# EAGLE schematic triple8_v2 (EAGLE 5.06)
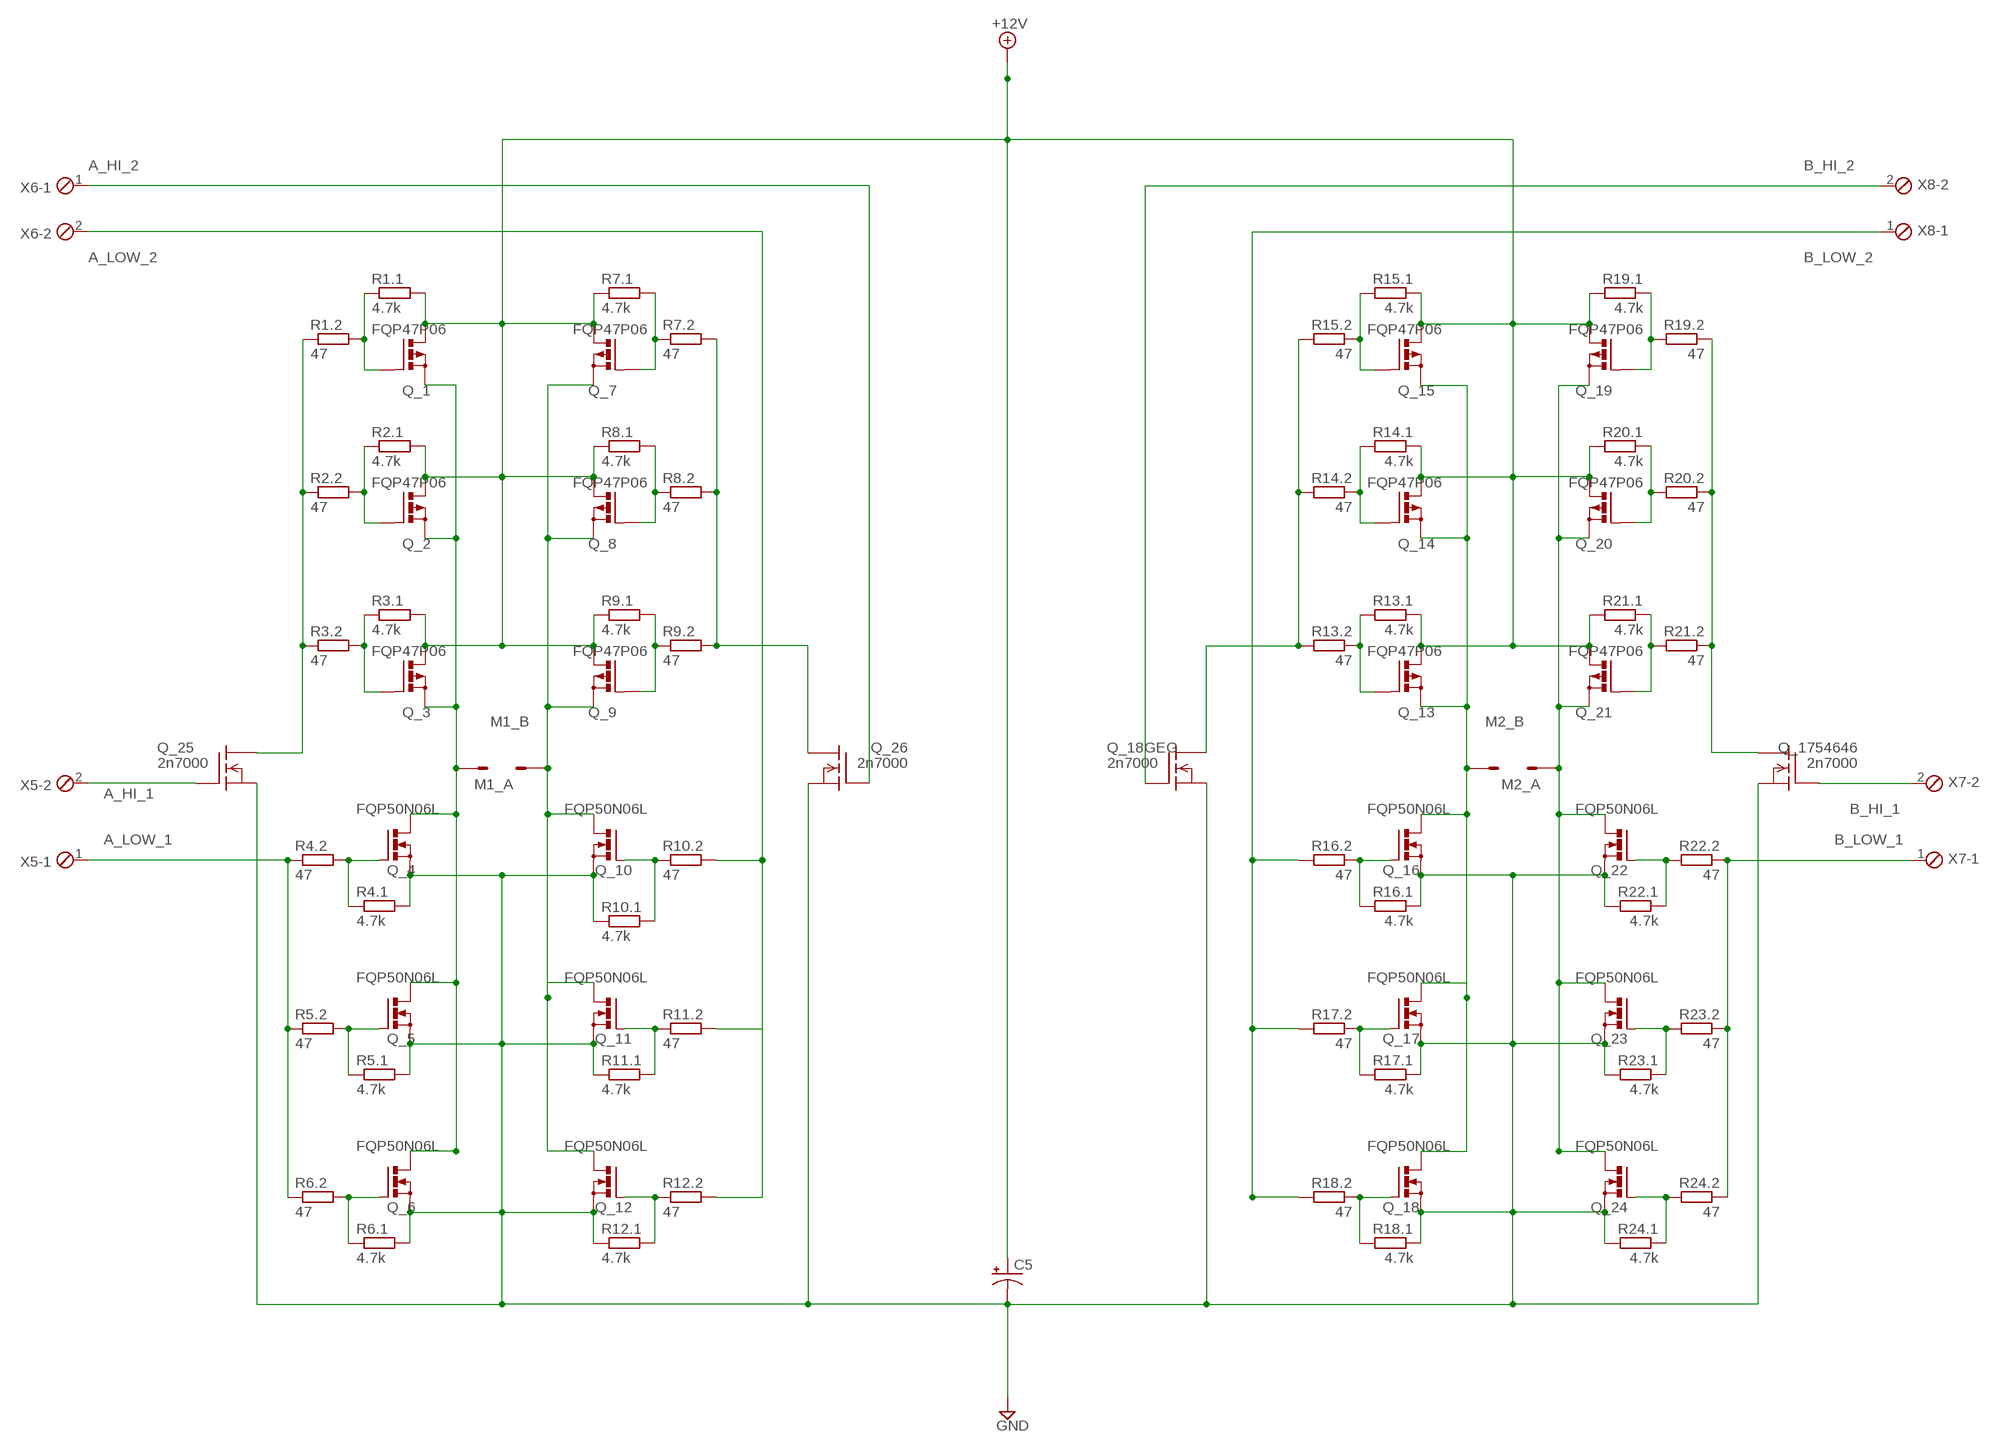
[diagram p0: schematic, sheet 1]

## Parts
C5  CPOL-USE10-22.5  [EB22,5D]
M1_A  ST2,8  [ST2,8]
M1_B  ST2,8  [ST2,8]
M2_A  ST2,8  [ST2,8]
M2_B  ST2,8  [ST2,8]
Q_1  FQP47P06  PMOSFET_PTO220BV  [TO220BV]
Q_2  FQP47P06  PMOSFET_PTO220BV  [TO220BV]
Q_3  FQP47P06  PMOSFET_PTO220BV  [TO220BV]
Q_4  FQP50N06L  PMOSFET_NTO220BV  [TO220BV]
Q_5  FQP50N06L  PMOSFET_NTO220BV  [TO220BV]
Q_6  FQP50N06L  PMOSFET_NTO220BV  [TO220BV]
Q_7  FQP47P06  PMOSFET_PTO220BV  [TO220BV]
Q_8  FQP47P06  PMOSFET_PTO220BV  [TO220BV]
Q_9  FQP47P06  PMOSFET_PTO220BV  [TO220BV]
Q_10  FQP50N06L  PMOSFET_NTO220BV  [TO220BV]
Q_11  FQP50N06L  PMOSFET_NTO220BV  [TO220BV]
Q_12  FQP50N06L  PMOSFET_NTO220BV  [TO220BV]
Q_13  FQP47P06  PMOSFET_PTO220BV  [TO220BV]
Q_14  FQP47P06  PMOSFET_PTO220BV  [TO220BV]
Q_15  FQP47P06  PMOSFET_PTO220BV  [TO220BV]
Q_16  FQP50N06L  PMOSFET_NTO220BV  [TO220BV]
Q_17  FQP50N06L  PMOSFET_NTO220BV  [TO220BV]
Q_18  FQP50N06L  PMOSFET_NTO220BV  [TO220BV]
Q_18GEG  2n7000  BSS101  [TO92]
Q_19  FQP47P06  PMOSFET_PTO220BV  [TO220BV]
Q_20  FQP47P06  PMOSFET_PTO220BV  [TO220BV]
Q_21  FQP47P06  PMOSFET_PTO220BV  [TO220BV]
Q_22  FQP50N06L  PMOSFET_NTO220BV  [TO220BV]
Q_23  FQP50N06L  PMOSFET_NTO220BV  [TO220BV]
Q_24  FQP50N06L  PMOSFET_NTO220BV  [TO220BV]
Q_25  2n7000  BSS101  [TO92]
Q_26  2n7000  BSS101  [TO92]
Q_1754646  2n7000  BSS101  [TO92]
R1.1  4.7k  R-EU_0204/5  [0204/5]
R1.2  47  R-EU_0204/5  [0204/5]
R2.1  4.7k  R-EU_0204/5  [0204/5]
R2.2  47  R-EU_0204/5  [0204/5]
R3.1  4.7k  R-EU_0204/5  [0204/5]
R3.2  47  R-EU_0204/5  [0204/5]
R4.1  4.7k  R-EU_0204/5  [0204/5]
R4.2  47  R-EU_0204/5  [0204/5]
R5.1  4.7k  R-EU_0204/5  [0204/5]
R5.2  47  R-EU_0204/5  [0204/5]
R6.1  4.7k  R-EU_0204/5  [0204/5]
R6.2  47  R-EU_0204/5  [0204/5]
R7.1  4.7k  R-EU_0204/5  [0204/5]
R7.2  47  R-EU_0204/5  [0204/5]
R8.1  4.7k  R-EU_0204/5  [0204/5]
R8.2  47  R-EU_0204/5  [0204/5]
R9.1  4.7k  R-EU_0204/5  [0204/5]
R9.2  47  R-EU_0204/5  [0204/5]
R10.1  4.7k  R-EU_0204/5  [0204/5]
R10.2  47  R-EU_0204/5  [0204/5]
R11.1  4.7k  R-EU_0204/5  [0204/5]
R11.2  47  R-EU_0204/5  [0204/5]
R12.1  4.7k  R-EU_0204/5  [0204/5]
R12.2  47  R-EU_0204/5  [0204/5]
R13.1  4.7k  R-EU_0204/5  [0204/5]
R13.2  47  R-EU_0204/5  [0204/5]
R14.1  4.7k  R-EU_0204/5  [0204/5]
R14.2  47  R-EU_0204/5  [0204/5]
R15.1  4.7k  R-EU_0204/5  [0204/5]
R15.2  47  R-EU_0204/5  [0204/5]
R16.1  4.7k  R-EU_0204/5  [0204/5]
R16.2  47  R-EU_0204/5  [0204/5]
R17.1  4.7k  R-EU_0204/5  [0204/5]
R17.2  47  R-EU_0204/5  [0204/5]
R18.1  4.7k  R-EU_0204/5  [0204/5]
R18.2  47  R-EU_0204/5  [0204/5]
R19.1  4.7k  R-EU_0204/5  [0204/5]
R19.2  47  R-EU_0204/5  [0204/5]
R20.1  4.7k  R-EU_0204/5  [0204/5]
R20.2  47  R-EU_0204/5  [0204/5]
R21.1  4.7k  R-EU_0204/5  [0204/5]
R21.2  47  R-EU_0204/5  [0204/5]
R22.1  4.7k  R-EU_0204/5  [0204/5]
R22.2  47  R-EU_0204/5  [0204/5]
R23.1  4.7k  R-EU_0204/5  [0204/5]
R23.2  47  R-EU_0204/5  [0204/5]
R24.1  4.7k  R-EU_0204/5  [0204/5]
R24.2  47  R-EU_0204/5  [0204/5]
X5  MPT2  [2POL254]
X6  MPT2  [2POL254]
X7  MPT2  [2POL254]
X8  MPT2  [2POL254]

## Nets
+12V: C5.+ Q_1.S(D) Q_2.S(D) Q_3.S(D) Q_7.S(D) Q_8.S(D) Q_9.S(D) Q_13.S(D) Q_14.S(D) Q_15.S(D) Q_19.S(D) Q_20.S(D) Q_21.S(D) R1.1.2 R2.1.2 R3.1.2 R7.1.1 R8.1.1 R9.1.1 R13.1.1 R14.1.1 R15.1.1 R19.1.2 R20.1.2 R21.1.2
A_HI_1: Q_25.2(G) X5.2
A_HI_2: Q_26.2(G) X6.1
A_LOW_1: R4.2.1 R5.2.1 R6.2.1 X5.1
A_LOW_2: R10.2.2 R11.2.2 R12.2.2 X6.2
B_HI_1: Q_1754646.2(G) X7.2
B_HI_2: Q_18GEG.2(G) X8.2
B_LOW_1: R22.2.1 R23.2.1 R24.2.1 X7.1
B_LOW_2: R16.2.2 R17.2.2 R18.2.2 X8.1
GND: C5.- Q_4.S Q_5.S Q_6.S Q_10.S Q_11.S Q_12.S Q_16.S Q_17.S Q_18.S Q_18GEG.1(S) Q_22.S Q_23.S Q_24.S Q_25.1(S) Q_26.1(S) Q_1754646.1(S) R4.1.2 R5.1.2 R6.1.2 R10.1.1 R11.1.1 R12.1.1 R16.1.1 R17.1.1 R18.1.1 R22.1.2 R23.1.2 R24.1.2
M1_A: M1_A.1(ST) Q_1.D(S) Q_2.D(S) Q_3.D(S) Q_4.D Q_5.D Q_6.D
M1_A1: M2_A.1(ST) Q_19.D(S) Q_20.D(S) Q_21.D(S) Q_22.D Q_23.D Q_24.D
M1_B: M1_B.1(ST) Q_7.D(S) Q_8.D(S) Q_9.D(S) Q_10.D Q_11.D Q_12.D
M1_B1: M2_B.1(ST) Q_13.D(S) Q_14.D(S) Q_15.D(S) Q_16.D Q_17.D Q_18.D
N$1: Q_5.G R5.1.1 R5.2.2
N$2: Q_13.G R13.1.2 R13.2.1
N$3: Q_4.G R4.1.1 R4.2.2
N$5: Q_21.G R21.1.1 R21.2.2
N$6: Q_2.G R2.1.1 R2.2.2
N$7: Q_22.G R22.1.1 R22.2.2
N$8: Q_25.3(D) R1.2.1 R2.2.1 R3.2.1
N$9: Q_16.G R16.1.2 R16.2.1
N$10: Q_3.G R3.1.1 R3.2.2
N$11: Q_9.G R9.1.2 R9.2.1
N$12: Q_20.G R20.1.1 R20.2.2
N$13: Q_19.G R19.1.1 R19.2.2
N$14: Q_1754646.3(D) R19.2.1 R20.2.1 R21.2.1
N$15: Q_14.G R14.1.2 R14.2.1
N$16: Q_15.G R15.1.2 R15.2.1
N$17: Q_18GEG.3(D) R13.2.2 R14.2.2 R15.2.2
N$18: Q_6.G R6.1.1 R6.2.2
N$19: Q_23.G R23.1.1 R23.2.2
N$20: Q_1.G R1.1.1 R1.2.2
N$21: Q_24.G R24.1.1 R24.2.2
N$22: Q_8.G R8.1.2 R8.2.1
N$23: Q_17.G R17.1.2 R17.2.1
N$24: Q_11.G R11.1.2 R11.2.1
N$25: Q_7.G R7.1.2 R7.2.1
N$26: Q_18.G R18.1.2 R18.2.1
N$27: Q_10.G R10.1.2 R10.2.1
N$29: Q_26.3(D) R7.2.2 R8.2.2 R9.2.2
N$31: Q_12.G R12.1.2 R12.2.1

## Library data of the parts
C5 = resistor:CPOL-US: POLARIZED CAPACITOR, American symbol
M1_A M1_B M2_A M2_B = con-rib:ST2,8: RIBBON CABLE CONNECTOR Flachstecker / Faston
Q_1-Q_3 Q_7-Q_9 Q_13-Q_15 Q_19-Q_21 = transistor-power2:PMOSFET_P: Power MOSFET P-Channel
Q_4-Q_6 Q_10-Q_12 Q_16-Q_18 Q_22-Q_24 = transistor-power2:PMOSFET_N: Power MOSFET N-Channel
Q_18GEG Q_25 Q_26 Q_1754646 = transistor-fet:BSS101: N-Channel Enhancement MOSFET 200V; 0,16A; 11Ohm
R1.1 R1.2 R2.1 R2.2 R3.1 R3.2 R4.1 R4.2 R5.1 R5.2 R6.1 R6.2 R7.1 R7.2 R8.1 R8.2 R9.1 R9.2 R10.1 R10.2 R11.1 R11.2 R12.1 R12.2 R13.1 R13.2 R14.1 R14.2 R15.1 R15.2 R16.1 R16.2 R17.1 R17.2 R18.1 R18.2 R19.1 R19.2 R20.1 R20.2 R21.1 R21.2 R22.1 R22.2 R23.1 R23.2 R24.1 R24.2 = rcl:R-EU_: RESISTOR, European symbol
X5-X8 = con-phoenix-254:MPT2: PHOENIX CONNECTOR